# Altium project KNX-POE-1_3.PrjPcb
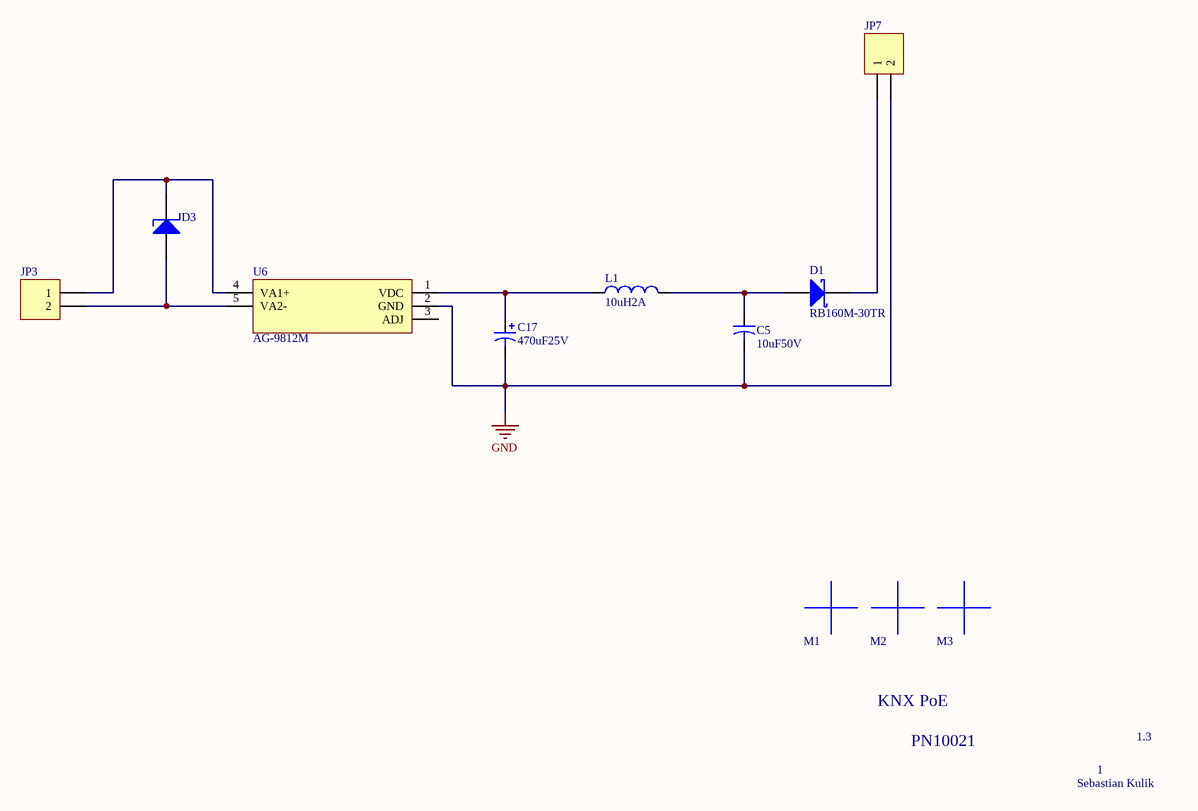
[diagram p0: KNX_POE.SchDoc]
1 sheet, 11 parts. Net scope: global (net labels, ports and power ports of the same name join across sheets).
Board file: KNX_POE.PcbDoc

## Sheet KNX_POE.SchDoc
size A4

### Parts
C5  value 10uF50V  [C1210]  (hidden comment: 10uF50V_1210)
C17  value 470uF25V  [Panasonic-FT-F_Case]  (hidden comment: 470uF25V_POL_FT)
D1  RB160M-30TR  [SOD123]
D3  SMAJ58A-E3/61  [DO214A]  (value not drawn)
JP3  Plug_2_90_2.54  [HDR1X2-down]  (value not drawn)
JP7  Plug_2_90_2.54  [HDR1X2-down]  (value not drawn)
L1  10uH2A  [WE-PD2_1]
M1  Paste Mark  [Mark-3mm]  (value not drawn)
M2  Paste Mark  [Mark-3mm]  (value not drawn)
M3  Paste Mark  [Mark-3mm]  (value not drawn)
U6  AG-9812M  [Ag9812M]

### Nets
GND: C5.2 C17.2 JP7.2 U6.2(GND)
NetC5_1: C5.1 D1.2(A) L1.2
NetC17_1: C17.1 L1.1 U6.1(VDC)
NetD1_1: D1.1(K) JP7.1
NetD3_1: D3.1(K) JP3.1 U6.4(VA1+)
NetD3_2: D3.2(A) JP3.2 U6.5(VA2-)

Not connected (* = marked no-connect by the designer): U6 3(ADJ)

### Notes on the sheet
- KNX PoE
- PN10021
- 1
- 1.3
- Sebastian Kulik

### Library data of the parts
C5 = 10uF50V_1210: AVX,  X7R, 10%, 50V; Deliverer PartNr: 2094047RL; Manufacturer PartNr: 12105C106KAT2A; Deliverer: Farnell; TDE-PN: C0039; Published: 17.02.2014; Part Description: AVX,  X7R, 10%, 50V; Publisher: Sebastian Kulik; PackageDescription: C1210; Manufacturer: AVX
C17 = 470uF25V_POL_FT: Panasonic, FT series; Deliverer PartNr: 1868411; Manufacturer PartNr: EEEFT1E471AP; Deliverer: Farnell; TDE-PN: C0048; Published: 23.09.2014; Part Description: Panasonic, FT series; Publisher: Sebastian Kulik; PackageDescription: Panasonic-FT-F; Manufacturer: Panasonic
D1 = RB160M-30TR: Diode Schottky,2A,40V; Deliverer PartNr: 1525480; Manufacturer: Rohm; TDE-PN: DIS0010; Deliverer: Farnell; Published: 17.02.2014; Publisher: Sebastian Kulik; PackageDescription: SOD123; Manufacturer PartNr: RB160M-30TR
D3 = SMAJ58A-E3/61: TVS, 400W, 58V; Deliverer PartNr: 1837053; Manufacturer: Vishay; TDE-PN: DIS0009; Deliverer: Farnell; Published: 17.02.2014; Publisher: Sebastian Kulik; PackageDescription: DO214AC; Manufacturer PartNr: SMAJ58A-E3/61
JP3 JP7 = Plug_2_90_2.54: Plug, 2-Pin; Manufacturer PartNr: 61300211021; Manufacturer: WE; Deliverer PartNr: 2356176; Deliverer: Farnell; TDE-PN: CON0010; LatestRevisionDate: 14.05.2014; LatestRevisionNote: Re-released for DXP Platform.; Publisher: Sebastian Kulik
L1 = 10uH2A_WE-PD2: WE-PD2, 10uH2A; Deliverer PartNr: 1636035; Manufacturer: WE; Manufacturer PartNr: 74477510; Deliverer: Farnell; TDE-PN: P0017; Published: 17.02.2014; Publisher: Sebastian Kulik; Value: 10uH2A; PackageDescription: WE-PD2_1
M1-M3 = Mark
U6 = AG-9812M: PoE, 12V; Manufacturer: Silvertel; TDE-PN: IC0052; Published: 17.02.2014; Deliverer PartNr: -; Deliverer: -; Publisher: Sebastian Kulik; Manufacturer PartNr: AG-9812M; PackageDescription: AG9812M